# Altium schematic sheet CATS-Vega-Frontend.SchDoc: CATS Vega
size A4; Author: Luca Jost; Revision: V1.0; SheetNumber: 15; SheetTotal: 16; Subtitle: Front End
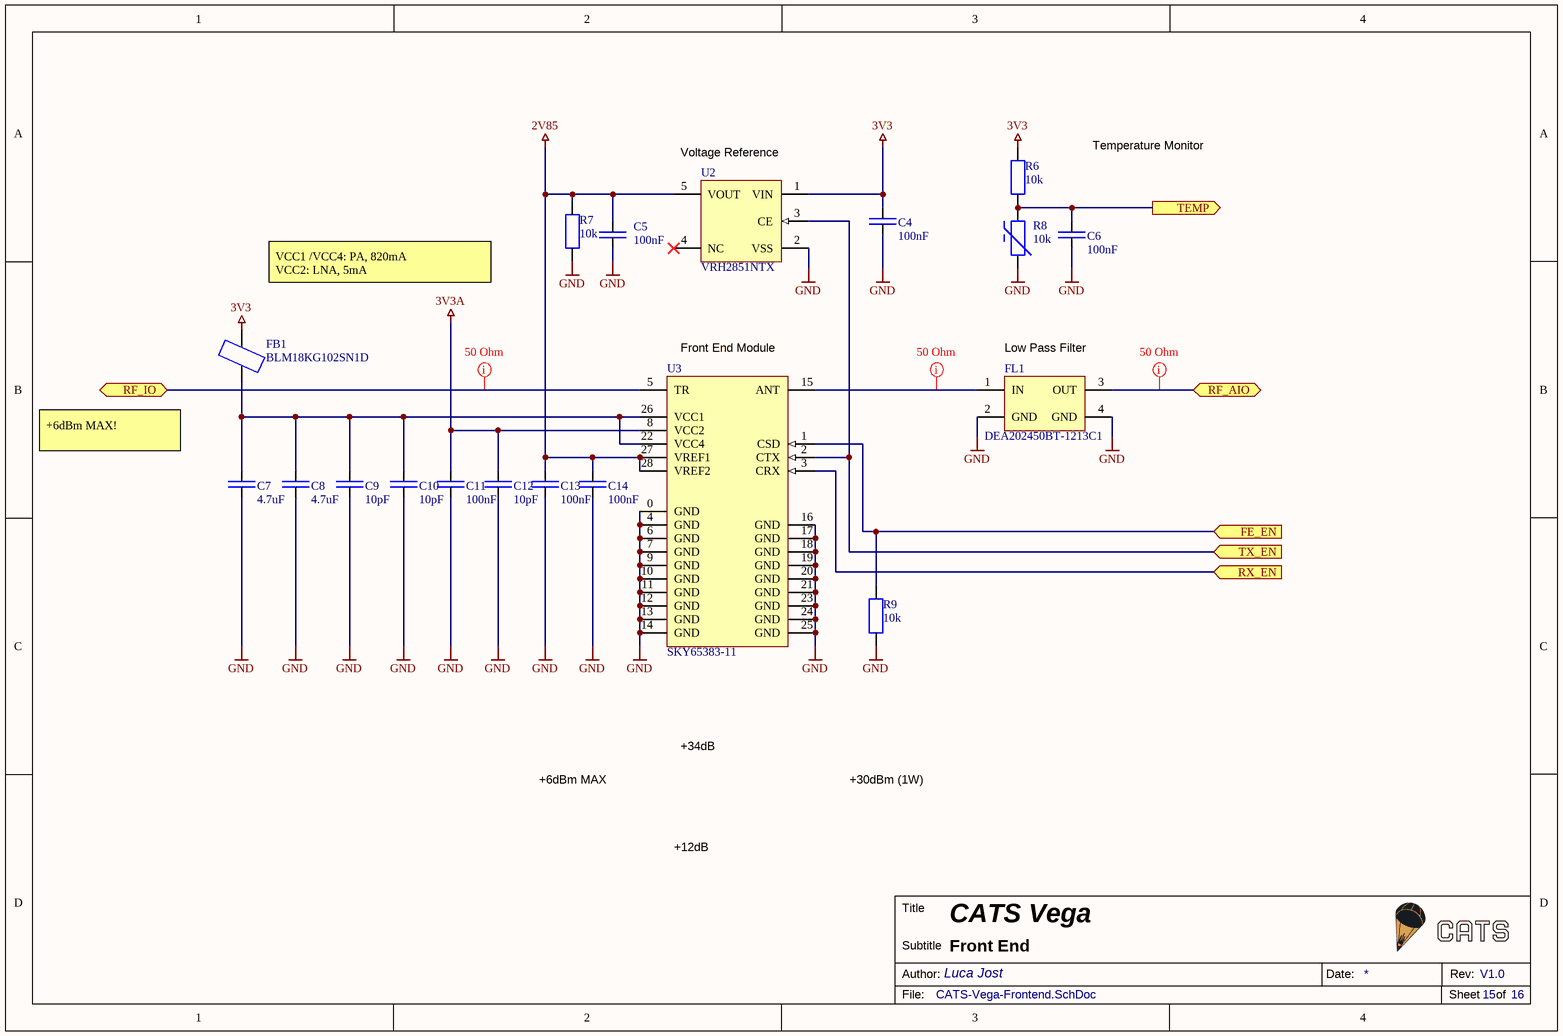
[diagram p0: CATS-Vega-Frontend.SchDoc]

## Parts
C4  100nF  [SMD Keramikkondensator 0603]
C5  100nF  [SMD Keramikkondensator 0603]
C6  100nF  [SMD Keramikkondensator 0603]
C7  4.7uF  [SMD Keramikkondensator 0603]
C8  4.7uF  [SMD Keramikkondensator 0603]
C9  10pF  [SMD Keramikkondensator 0603]
C10  10pF  [SMD Keramikkondensator 0603]
C11  100nF  [SMD Keramikkondensator 0603]
C12  10pF  [SMD Keramikkondensator 0603]
C13  100nF  [SMD Keramikkondensator 0603]
C14  100nF  [SMD Keramikkondensator 0603]
FB1  BLM18KG102SN1D  [SMD Ferrite Bead 0603]
FL1  DEA202450BT-1213C1  [SMD Filter DEA202450BT]
R6  10k  [SMD Widerstand 0603]
R7  10k  [SMD Widerstand 0603]
R8  10k  [SMD NTC 0603]
R9  10k  [SMD Widerstand 0603]
U2  VRH2851NTX  [SMD IC SOT-23-5]
U3  SKY65383-11  [SMD IC 28-MCM]

## Ports
FE_EN (in), RF_AIO (bidir), RF_IO (bidir), RX_EN (in), TEMP (out), TX_EN (in)

## Nets
2V85: C5.2 C13.2 C14.2 R7.2 U2.5(VOUT) U3.27(VREF1) U3.28(VREF2)
3V3: C4.2 FB1.2 R6.2 U2.1(VIN)
3V3A: C11.2 C12.2 U3.8(VCC2)
GND: C4.1 C5.1 C6.1 C7.1 C8.1 C9.1 C10.1 C11.1 C12.1 C13.1 C14.1 FL1.2(GND) FL1.4(GND) R7.1 R8.2 R9.1 U2.2(VSS) U3.0(GND) U3.4(GND) U3.6(GND) U3.7(GND) U3.9(GND) U3.10(GND) U3.11(GND) U3.12(GND) U3.13(GND) U3.14(GND) U3.16(GND) U3.17(GND) U3.18(GND) U3.19(GND) U3.20(GND) U3.21(GND) U3.23(GND) U3.24(GND) U3.25(GND)
FE_EN: R9.2 U3.1(CSD) ; port FE_EN
RF_AIO: FL1.3(OUT) ; port RF_AIO
RF_IO: U3.5(TR) ; port RF_IO
RX_EN: U3.3(CRX) ; port RX_EN
TEMP: C6.2 R6.1 R8.1 ; port TEMP
TX_EN: U2.3(CE) U3.2(CTX) ; port TX_EN
NetC7_2: C7.2 C8.2 C9.2 C10.2 FB1.1 U3.22(VCC4) U3.26(VCC1)
NetFL1_1: FL1.1(IN) U3.15(ANT)

Not connected (* = marked no-connect by the designer): U2 4(NC)*

## Layout directives
rule Impedance Constraint [Min = 50.00    Max = 50.00    ]; net class RF-Line 50: NetFL1_1, RF_AIO, RF_IO

## Notes on the sheet
- (near U2) Voltage Reference
- Temperature Monitor
- VCC1 /VCC4: PA, 820mA
  VCC2: LNA, 5mA
- (near U3) Front End Module
- (near FL1) Low Pass Filter
- +6dBm MAX!
- +6dBm MAX
- +34dB
- +30dBm (1W)
- +12dB
- Title
- Author:
- Subtitle
- Date:
- Rev:
- File:
- Sheet
- of

## Library data of the parts
C4-C6 C11 C13 C14 = E6 - 100nF: SMD Ceramic Capacitor E6; Unit Price: 0.0024; JLC: C1591
C7 C8 = E6 - 4.7uF: SMD Ceramic Capacitor E6; Unit Price: 0.0082; JLC: C19666
C9 C10 C12 = E6 - 10pF: SMD Ceramic Capacitor E6; Unit Price: 0.0055; JLC: C1634
FB1 = BLM18KG102SN1D: 1 kOhms @ 100MHz 1 Power Line Ferrite Bead 0603 (1608 Metric) 1A 200mOhm; ComponentLink1Description: Datasheet; ComponentLink1URL: https://www.murata.com/en-us/products/productdata/8796738650142/ENFA0003.pdf; Digikey: 490-17349-1-ND; JLC: C42102; Unit Price: 0.0058
FL1 = DEA202450BT-1213C1: Multilayer Band Pass Filter 2400-2500MHz; ComponentLink1Description: Datasheet; ComponentLink1URL: https://datasheet.lcsc.com/lcsc/1811021613_TDK-DEA202450BT-1213C1_C307898.pdf; JLC: C307898; Digikey: 445-3969-2-ND; Mouser: 810-DEA22450BT1213C1; Unit Price: 0.1188
R6 R7 R9 = E24 - 10k: SMD Chip Resistor E24; Unit Price: 0.001; JLC: C99198
R8 = SDNT1608X103F3450FTF: NTC 10kΩ -55℃~+125℃ 0.31mA 100mW ±1% 3450K; JLC: C95953; Unit Price: 0.0192; ComponentLink1Description: Datasheet; ComponentLink1URL: https://datasheet.lcsc.com/lcsc/2110081230_Sunlord-SDNT1608X103F3450FTF_C95953.pdf
U2 = VRH2851NTX: Linear Voltage Regulator IC Positive Fixed 1 Output  250mA SOT-23-5 2.85V; ComponentLink1Description: Datasheet; ComponentLink1URL: https://datasheet.lcsc.com/lcsc/2007221906_AnaSem-VRH2851NTX_C697994.pdf; JLC: C697994; Unit Price: 0.0585
U3 = SKY65383-11: 2400 to 2483 MHz Transmit/Receive / Front-End Module +30dBm; ComponentLink1Description: Datasheet; ComponentLink1URL: https://www.skyworksinc.com/-/media/SkyWorks/Documents/Products/2901-3000/SKY65383-11_202668G.pdf; Digikey: 863-1798-1-ND; Mouser: 873-SKY65383-11; Unit Price: 4.16720